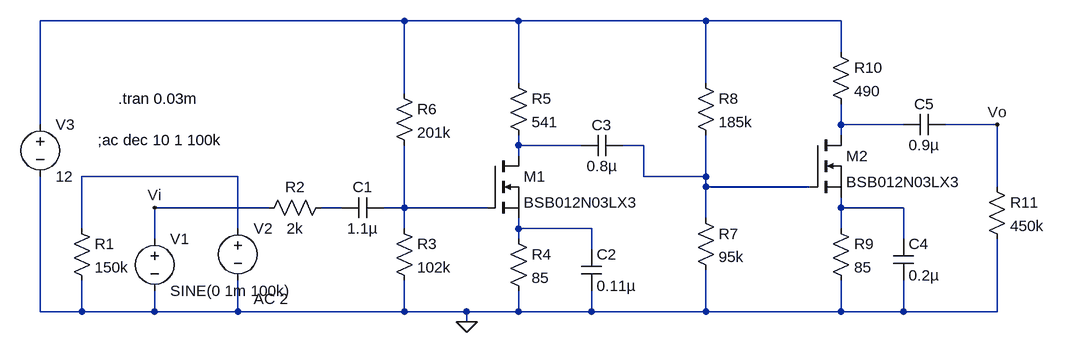
[diagram p0: schematic 4.asc]
4.asc, the LTspice schematic file:
Version 4
SHEET 1 1536 680
WIRE 544 -192 -16 -192
WIRE 720 -192 544 -192
WIRE 1008 -192 720 -192
WIRE 1216 -192 1008 -192
WIRE 1216 -144 1216 -192
WIRE 720 -96 720 -192
WIRE 1008 -96 1008 -192
WIRE 544 -80 544 -192
WIRE -16 -32 -16 -192
WIRE 1216 -32 1216 -64
WIRE 1312 -32 1216 -32
WIRE 1456 -32 1376 -32
WIRE 1216 -16 1216 -32
WIRE 720 0 720 -16
WIRE 816 0 720 0
WIRE 912 0 880 0
WIRE 720 16 720 0
WIRE 288 48 48 48
WIRE 912 48 912 0
WIRE 1008 48 1008 -16
WIRE 1008 48 912 48
WIRE 1008 64 1008 48
WIRE 1168 64 1008 64
WIRE 1456 64 1456 -32
WIRE 336 96 160 96
WIRE 448 96 416 96
WIRE 544 96 544 0
WIRE 544 96 512 96
WIRE 672 96 544 96
WIRE 1216 96 1216 80
WIRE 1312 96 1216 96
WIRE 1008 112 1008 64
WIRE 48 128 48 48
WIRE 288 128 288 48
WIRE 544 128 544 96
WIRE 720 128 720 112
WIRE 832 128 720 128
WIRE 1216 128 1216 96
WIRE 160 144 160 96
WIRE 720 144 720 128
WIRE 1312 144 1312 96
WIRE 832 160 832 128
WIRE -16 256 -16 48
WIRE 48 256 48 208
WIRE 48 256 -16 256
WIRE 160 256 160 224
WIRE 160 256 48 256
WIRE 288 256 288 208
WIRE 288 256 160 256
WIRE 544 256 544 208
WIRE 544 256 288 256
WIRE 640 256 544 256
WIRE 720 256 720 224
WIRE 720 256 640 256
WIRE 832 256 832 224
WIRE 832 256 720 256
WIRE 1008 256 1008 192
WIRE 1008 256 832 256
WIRE 1216 256 1216 208
WIRE 1216 256 1008 256
WIRE 1312 256 1312 208
WIRE 1312 256 1216 256
WIRE 1456 256 1456 144
WIRE 1456 256 1312 256
WIRE 640 272 640 256
FLAG 640 272 0
FLAG 1456 -32 Vo
FLAG 160 96 Vi
SYMBOL res 32 112 R0
SYMATTR InstName R1
SYMATTR Value 150k
SYMBOL voltage 160 128 R0
WINDOW 123 0 0 Left 0
WINDOW 39 0 0 Left 0
SYMATTR InstName V1
SYMATTR Value SINE(0 1m 100k)
SYMBOL voltage 288 112 R0
WINDOW 123 24 124 Left 2
WINDOW 39 0 0 Left 0
SYMATTR Value2 AC 2
SYMATTR InstName V2
SYMATTR Value ""
SYMBOL res 432 80 R90
WINDOW 0 0 56 VBottom 2
WINDOW 3 32 56 VTop 2
SYMATTR InstName R2
SYMATTR Value 2k
SYMBOL cap 512 80 R90
WINDOW 0 0 32 VBottom 2
WINDOW 3 32 32 VTop 2
SYMATTR InstName C1
SYMATTR Value 1.1µ
SYMBOL res 528 112 R0
SYMATTR InstName R3
SYMATTR Value 102k
SYMBOL nmos 672 16 R0
SYMATTR InstName M1
SYMATTR Value BSB012N03LX3
SYMBOL res 704 128 R0
SYMATTR InstName R4
SYMATTR Value 85
SYMBOL res 704 -112 R0
SYMATTR InstName R5
SYMATTR Value 541
SYMBOL res 528 -96 R0
SYMATTR InstName R6
SYMATTR Value 201k
SYMBOL cap 816 160 R0
SYMATTR InstName C2
SYMATTR Value 0.11µ
SYMBOL cap 880 -16 R90
WINDOW 0 0 32 VBottom 2
WINDOW 3 32 32 VTop 2
SYMATTR InstName C3
SYMATTR Value 0.8µ
SYMBOL res 992 96 R0
SYMATTR InstName R7
SYMATTR Value 95k
SYMBOL res 992 -112 R0
SYMATTR InstName R8
SYMATTR Value 185k
SYMBOL nmos 1168 -16 R0
SYMATTR InstName M2
SYMATTR Value BSB012N03LX3
SYMBOL res 1200 112 R0
SYMATTR InstName R9
SYMATTR Value 85
SYMBOL cap 1296 144 R0
SYMATTR InstName C4
SYMATTR Value 0.2µ
SYMBOL res 1200 -160 R0
SYMATTR InstName R10
SYMATTR Value 490
SYMBOL res 1440 48 R0
SYMATTR InstName R11
SYMATTR Value 450k
SYMBOL cap 1376 -48 R90
WINDOW 0 0 32 VBottom 2
WINDOW 3 32 32 VTop 2
SYMATTR InstName C5
SYMATTR Value 0.9µ
SYMBOL voltage -16 -48 R0
WINDOW 123 0 0 Left 0
WINDOW 39 0 0 Left 0
SYMATTR InstName V3
SYMATTR Value 12
TEXT 72 -8 Left 2 !;ac dec 10 1 100k
TEXT 104 -72 Left 2 !.tran 0.03m

The netlist it stands for:
* 4.asc
R1 N005 0 150k
V1 Vi 0 SINE(0 1m 100k)
V2 N005 0 AC 2
R2 N006 Vi 2k
C1 N007 N006 1.1µ
R3 N007 0 102k
M1 N003 N007 N009 N009 BSB012N03LX3
R4 N009 0 85
R5 N001 N003 541
R6 N001 N007 201k
C2 N009 0 0.11µ
C3 N004 N003 0.8µ
R7 N004 0 95k
R8 N001 N004 185k
M2 N002 N004 N008 N008 BSB012N03LX3
R9 N008 0 85
C4 N008 0 0.2µ
R10 N001 N002 490
R11 Vo 0 450k
C5 Vo N002 0.9µ
V3 N001 0 12
.model NMOS NMOS
.model PMOS PMOS
.lib standard.mos
;ac dec 10 1 100k
.tran 0.03m
.backanno
.end